# EAGLE design ATtiny Vario (EAGLE 7.2.0)
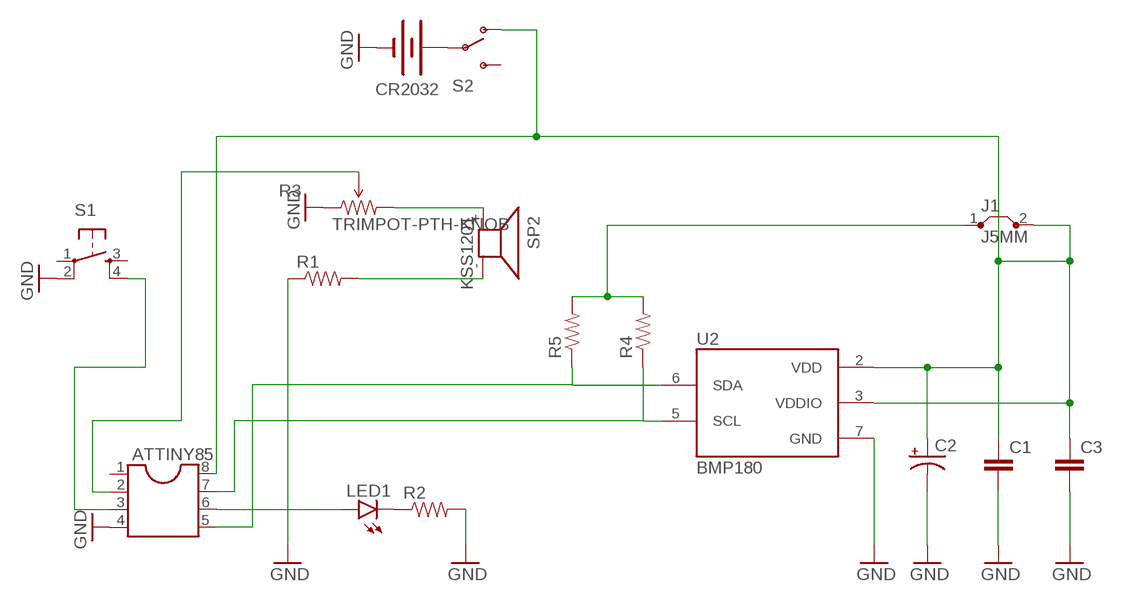
[diagram p0: schematic, sheet 1]

## Parts
ATTINY85  DIL8S  [SOCKET-08]
C1  CAPPTH  [CAP-PTH-SMALL]
C2  CAP_POLPTH2  [CPOL-RADIAL-10UF-25V]
C3  CAPPTH  [CAP-PTH-SMALL]
CR2032  BATTERY20PTH  [BATTCOM_20MM_PTH]
J1  J5MM  [05]
LED1  LED3MM  [LED3MM]
R1  RESISTOREZ  [AXIAL-0.3EZ]
R2  RESISTORPTH-1/6W  [1/6W-RES]
R3  TRIMPOT-PTH-KNOB  [3386U]
R4  RESISTOREZ  [AXIAL-0.3EZ]
R5  RESISTOREZ  [AXIAL-0.3EZ]
S1  TAC_SWITCHPTH  [TACTILE-PTH]
S2  SWITCH-SPDTPTH  [SWITCH-SPDT]
SP2  KSS1201  [KSS1201]
U2  BMP180  [BMP180]

## Nets
GND: ATTINY85.4 C1.2 C2.2(-) C3.2 CR2032.2(-) R1.P$1 R2.2 R3.1(CCW) S1.2 U2.7(GND)
N$1: CR2032.1(+) S2.2(P)
N$2: ATTINY85.5 R5.P$1 U2.6(SDA)
N$3: LED1.K(C) R2.1
N$4: R1.P$2 SP2.-
N$5: ATTINY85.8 C1.1 C2.1(+) C3.1 J1.2 S2.1(O) U2.2(VDD) U2.3(VDDIO)
N$6: R3.3(CW) SP2.+
N$7: ATTINY85.2 R3.2(WIPER)
N$8: ATTINY85.3 S1.4
N$9: ATTINY85.6 LED1.A
N$10: J1.1 R4.P$2 R5.P$2
N$12: ATTINY85.7 R4.P$1 U2.5(SCL)
Unconnected: ATTINY85.1 S1.1 S1.3 S2.3(S)

## Library data of the parts
ATTINY85 = ic-package:DIL8: Dual In Line / Socket
C1 C3 = SparkFun-Capacitors:CAP: Capacitor Standard 0603 ceramic capacitor, and 0.1" leaded capacitor.
C2 = SparkFun-Capacitors:CAP_POL: Capacitor Polarized These are standard SMD and PTH capacitors. Normally 10uF, 47uF, and 100uF in electrolytic and tantalum varieties. Always verify the external diameter of the through hole cap, it varies with capacity, voltage, and manufacturer. The EIA devices should be standard.
CR2032 = SparkFun-Electromechanical:BATTERY: Battery Holders Various common sizes : AA, AAA, 18650 (PRT-12895), 20mm coin cell and 12mm coin cell. 20MM_4LEGS, BATT-10373
J1 = jumper:J: Bridge
LED1 = SparkFun-LED:LED: LEDs Standard schematic elements and footprints for 5mm, 3mm, 1206, and 0603 sized LEDs. 5mm - Spark Fun Electronics SKU : COM-00529 (and others)
R1 R2 R4 R5 = SparkFun-Passives:RESISTOR: Resistor Basic schematic elements and footprints for 0603, 1206, and PTH resistors.
R3 = SparkFun-Electromechanical:TRIMPOT: Various small potentiometers for "set-and-forget" applications
S1 = SparkFun-Retired:TAC_SWITCH: Momentary Switch Button commonly used for reset or general input. Spark Fun Electronics SKU : COM-00097 SMT- SWCH-08247
S2 = SparkFun-Electromechanical:SWITCH-SPDT: SPDT Switch Simple slide switch, Spark Fun Electronics SKU : COM-00102 DPDT SMT slide switch, AYZ0202, SWCH-08179; PROD_ID: SWCH-08261
SP2 = buzzer:KSS1201: SPEAKER Source: Schukat; OC_FARNELL: unknown; OC_NEWARK: unknown
U2 = SparkFun-Sensors:BMP180: BOSCH BMP180 DIGITAL BAROMETRIC PRESSURE SENSOR Web page: http://www.bosch-sensortec.com/en/homepage/products_3/environmental_sensors_1/bmp180_1/bmp180 Datasheet: http://ae-bst.resource.bosch.com/media/products/dokumente/bmp180/BST-BMP180-DS000-09.pdf The BMP180 is the function compatible successor of the BMP085, a new generation of high precision digital pressure sensors for consumer applications. The ultra-low power, low voltage electronics of the BMP180 is optimized for use in mobile phones, PDAs, GPS navigation devices and outdoor equipment. With a low altitude noise of merely 0.25m at fast conversion time, the BMP180 offers superior performance. The I2C interface allows for easy system integration with a microcontroller. The BMP180 is based on piezo-resistive technology for EMC robustness, high accuracy and linearity as well as long term stability. Key features: - Temperature measurement included - I2C interface - Fully calibrated - Pb-free, halogen-free and RoHS compliant, - MSL 1 Basic specs: Pressure range: 300 to 1100hPa (+9000m to -500m relating to sea level) Supply voltage: 1.8 to 3.6V (VDD), 1.62V to 3.6V (VDDIO) Package: LGA package with metal lid Small footprint: 3.6mm x 3.8mm Super-flat: 0.93mm height Low power: 5μA at 1 sample / sec. in standard mode Low noise: 0.06hPa (0.5m) in ultra low power mode, 0.02hPa (0.17m) advanced resolution mode Typical applications: - Enhancement of GPS navigation (dead-reckoning, slope detection, etc.) - In- and out-door navigation - Leisure and sports - Weather forecast - Vertical velocity indication (rise/sink speed)

## Net classes
0 default: width 0.381 mm, drill 0.508 mm, clearance 0.381 mm

## Board
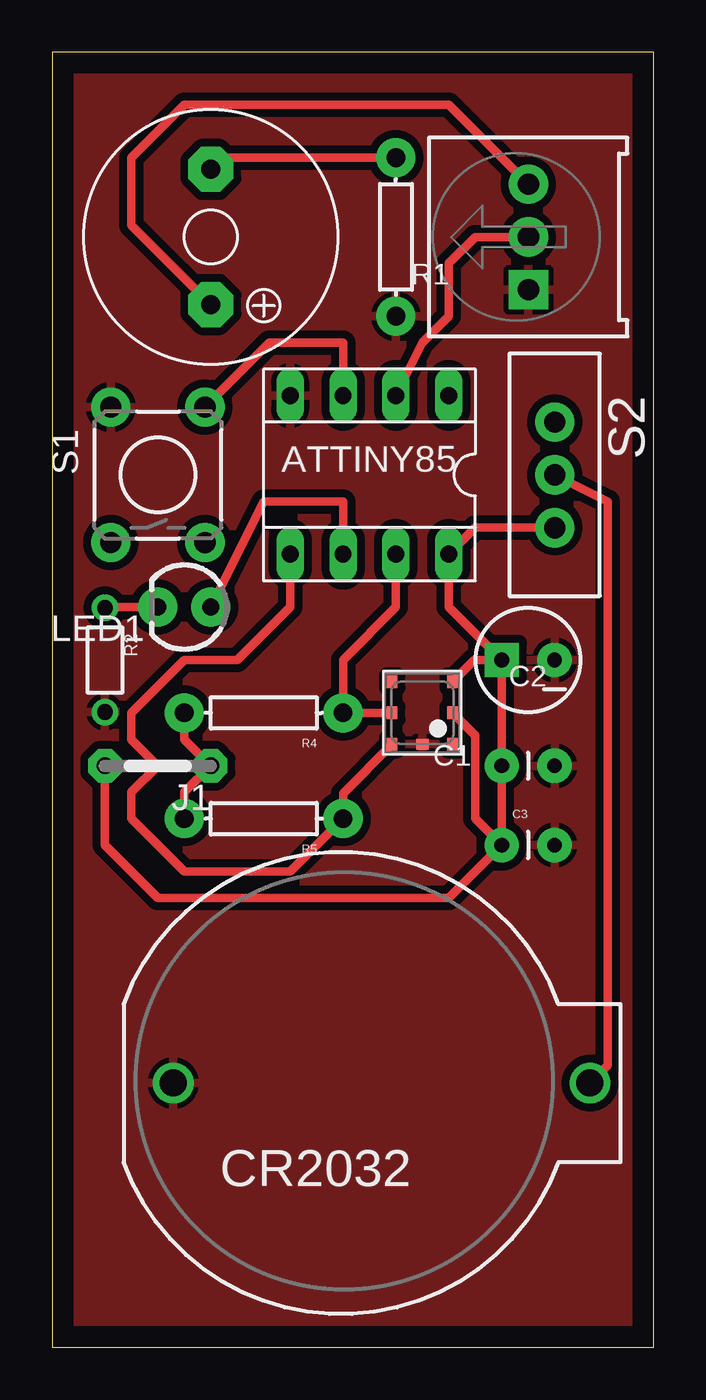
[diagram p1: board, top side]

Size 28.88 x 62.22 mm. Coordinates in mm from the lower left corner, seen from the top.
Outline: 0,0 28.88,0 28.88,62.22 0,62.22 0,0
Copper layers (1*16): Top 0.035mm / dielectric 1.5mm / Bottom 0.035mm
Design rules "default": minimum track width 10mil, minimum drill 24mil, track to track 8mil, track to pad 8mil, pad to pad 8mil, via to via 8mil, smd to smd 8mil, copper to edge 40mil, drill to drill 8mil, minimum pad ring 10mil, minimum via ring 8mil, stop-mask expansion 4mil, vias tented up to drill 0mil, thermal gap 10mil

### Footprints (pad centres in the part's own frame; a part is rotated, then mirrored left to right if it is on the bottom)
SOCKET-08 = drill 0.813 long: 1 -3.81,-3.81; 2 -1.27,-3.81; 3 1.27,-3.81; 4 3.81,-3.81; 5 3.81,3.81; 6 1.27,3.81; 7 -1.27,3.81; 8 -3.81,3.81
CAP-PTH-SMALL = drill 0.7 pad 1.651: 1 0,0; 2 2.54,0
CPOL-RADIAL-10UF-25V = drill 0.7 pad 1.651 square: 1 1.27,0 | drill 0.7 pad 1.651: 2 -1.27,0
BATTCOM_20MM_PTH = drill 1.3: 1 11.85,0; 2 -8.15,0
05 = drill 0.813 pad 1.6 octagon: 1 -2.54,0; 2 2.54,0
LED3MM = drill 0.813 pad 1.88: A -1.27,0; K 1.27,0
AXIAL-0.3EZ = drill 0.9 pad 1.88: P$1 -3.81,0; P$2 3.81,0
1/6W-RES = drill 0.762: 1 -2.5,0; 2 2.5,0
3386U = drill 1.016 pad 1.88 square: 1 -2.54,-0.015 | drill 1.016 pad 1.88: 2 0,-0.015; 3 2.54,-0.015
TACTILE-PTH = drill 1.016 pad 1.88: 1 -3.251,2.261; 2 3.251,2.261; 3 -3.251,-2.261; 4 3.251,-2.261
SWITCH-SPDT = drill 1.016 pad 1.88: 1 0,2.54; 2 0,0; 3 0,-2.54
KSS1201 = drill 0.914 pad 2.159 octagon: + 3.251,0; - -3.251,0
BMP180 = smd 0.6 x 0.5: 1 1.5,1.45; 2 0,1.45; 3 -1.5,1.45; 4 -1.5,-1.45; 5 0,-1.45; 6 1.5,-1.45 | smd 0.5 x 0.6: 7 1.5,0

### Placement (x,y rotation side)
ATTINY85  15.24,41.91 180 top
C1  21.59,27.94 0 top
C2  22.86,33.02 180 top
C3  21.59,24.13 0 top
CR2032  13.97,12.7 0 top
J1  5.08,27.94 180 top
LED1  6.35,35.56 180 top
R1  16.51,53.34 90 top
R2  2.54,33.02 270 top
R3  22.86,53.34 90 top
R4  10.16,30.48 180 top
R5  10.16,25.4 180 top
S1  5.08,41.91 90 top
S2  24.13,41.91 180 top
SP2  7.62,53.34 270 top
U2  17.78,30.48 270 top

### Tracks (layer width: path | path; a pad name or v marks a point on that pad's centre or on a via)
GND
  pour Top: -1.27,63.5 30.48,63.5 30.48,-1.27 -1.27,-1.27
N$1
  Top 0.406: S2.2 26.67,40.64 26.67,13.55 CR2032.1
N$2
  Top 0.406: ATTINY85.5 11.43,35.56 8.89,33.02 6.35,33.02 3.81,30.48 3.81,29.21 5.08,27.94 3.81,26.67 3.81,25.4 6.35,22.86 11.43,22.86 R5.P$1 13.97,26.62 U2.6
N$3
  Top 0.406: LED1.K 2.58,35.56 R2.1
N$4
  Top 0.406: R1.P$2 8.18,57.15 SP2.-
N$5
  Top 0.406: S2.1 20.32,39.37 ATTINY85.8 19.05,35.56 C2.1 | C3.1 20.32,25.4 20.32,29.39 U2.2 | C2.1 20.27,33.02 U2.3 | C3.1 C1.1 C2.1 | J1.2 2.54,24.13 5.08,21.59 19.05,21.59 C3.1
N$6
  Top 0.406: R3.3 22.86,55.88 19.05,59.69 6.35,59.69 3.81,57.15 3.81,53.9 SP2.+
N$7
  Top 0.406: R3.2 20.32,53.34 19.05,52.07 19.05,49.53 17.78,48.26 ATTINY85.2
N$8
  Top 0.406: ATTINY85.3 13.97,48.26 10.44,48.26 S1.4
N$9
  Top 0.406: ATTINY85.6 13.97,40.64 10.16,40.64 LED1.A
N$10
  Top 0.406: R4.P$2 6.35,29.21 J1.1 6.35,26.67 R5.P$2
N$12
  Top 0.406: U2.5 R4.P$1 13.97,33.02 16.51,35.56 ATTINY85.7